# EAGLE design Board_Core (EAGLE 8.2.0)
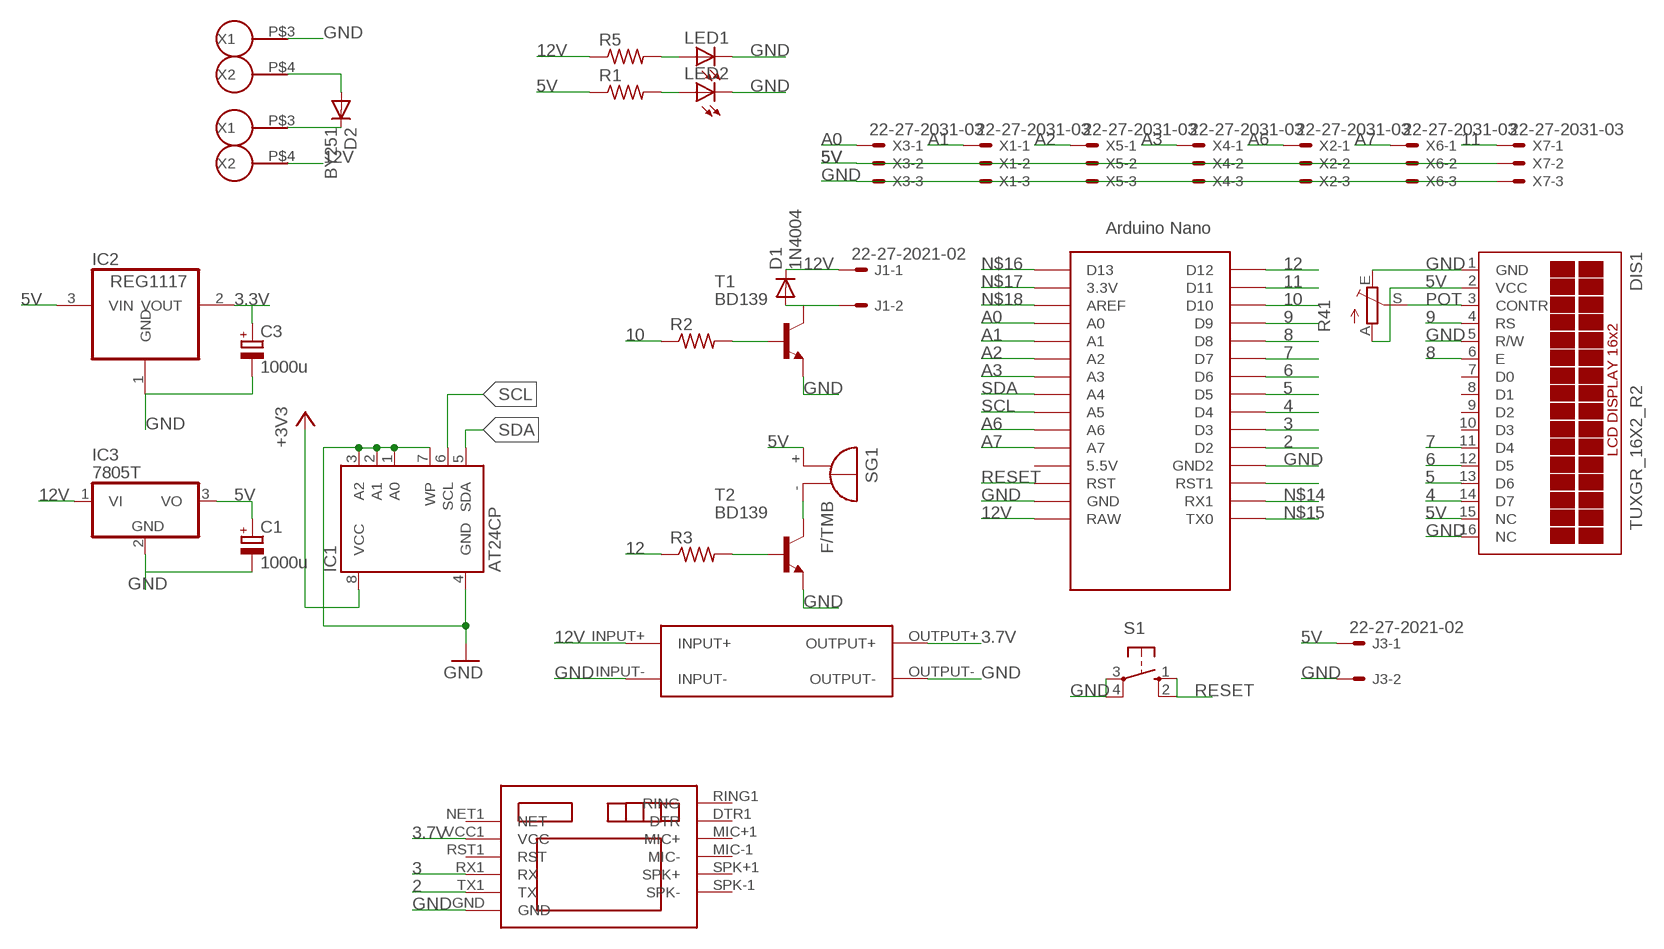
[diagram p0: schematic, sheet 1]

## Parts
C1  1000u  CPOL-EUE5-10.5  [E5-10,5]
C3  1000u  CPOL-EUE5-10.5  [E5-10,5]
D1  1N4004  [DO41-10]
D2  BY251  [DO201-15]
DIS1  TUXGR_16X2_R2  [TUXGR_16X2_R2]
IC1  AT24CP  [DIL08]
IC2  REG1117  [SOT223]
IC3  7805T  [TO220H]
J1  22-27-2021-02  [6410-02]
J3  22-27-2021-02  [6410-02]
LED1  LED5MM  [LED5MM]
LED2  LED5MM  [LED5MM]
R1  R-US_0207/10  [0207/10]
R2  R-US_0207/10  [0207/10]
R3  R-US_0207/10  [0207/10]
R5  R-US_0207/10  [0207/10]
R41  TRIM_EU-CA6V  [CA6V]
S1  40-XX  [B3F-40XX]
SG1  F/TMB  [F/TMB]
T1  BD139  [TO126]
T2  BD139  [TO126]
U$1  NANO  [NANO]
U$2  UBEC  [UBEC]
U$3  TB9.5  [TB9.5]
U$4  SIM800L(F.D)  [SIM800L]
U$8  TB9.5  [TB9.5]
X1  22-27-2031-03  [6410-03]
X2  22-27-2031-03  [6410-03]
X3  22-27-2031-03  [6410-03]
X4  22-27-2031-03  [6410-03]
X5  22-27-2031-03  [6410-03]
X6  22-27-2031-03  [6410-03]
X7  22-27-2031-03  [6410-03]

## Nets
2: U$1.D2 U$4.TX1(TX)
3: U$1.D3 U$4.RX1(RX)
3.3V: C3.+ IC1.8(VCC) IC2.2(VOUT) ; supply symbol labelled +3V3
3.7V: U$2.OUTPUT+ U$4.VCC1(VCC)
4: DIS1.14(D7) U$1.D4
5: DIS1.13(D6) U$1.D5
5V: C1.+ DIS1.2(VCC) DIS1.15(NC) IC2.3(VIN) IC3.3(VO) J3.1 R1.1 R41.A SG1.+ X1.2 X2.2 X3.2 X4.2 X5.2 X6.2 X7.2
6: DIS1.12(D5) U$1.D6
7: DIS1.11(D4) U$1.D7
8: DIS1.6(E) U$1.D8
9: DIS1.4(RS) U$1.D9
10: R2.1 U$1.D10
11: U$1.D11 X7.1
12: R3.1 U$1.D12
12V: D1.C IC3.1(VI) J1.1 R5.1 U$1.RAW U$2.INPUT+ U$3.P$4(X2)
A0: U$1.A0 X3.1
A1: U$1.A1 X1.1
A2: U$1.A2 X5.1
A3: U$1.A3 X4.1
A6: U$1.A6 X2.1
A7: U$1.A7 X6.1
GND: C1.- C3.- DIS1.1(GND) DIS1.5(R/W) DIS1.16(NC) IC1.1(A0) IC1.2(A1) IC1.3(A2) IC1.4(GND) IC1.7(WP) IC2.1(GND) IC3.2(GND) J3.2 LED1.K(C) LED2.K(C) R41.E S1.3(P) S1.4(P1) T1.1(E) T2.1(E) U$1.GND U$1.GND1(GND2) U$2.INPUT- U$2.OUTPUT- U$4.GND U$8.P$3(X1) X1.3 X2.3 X3.3 X4.3 X5.3 X6.3 X7.3
GND1: D2.A U$8.P$4(X2)
N$3: LED1.A R5.2
N$4: R2.2 T1.3(B)
N$5: D1.A J1.2 T1.2(C)
N$6: U$1.RST1
N$8: LED2.A R1.2
N$9: D2.C U$3.P$3(X1)
N$10: R3.2 T2.3(B)
N$11: SG1.- T2.2(C)
N$14: U$1.RX1
N$15: U$1.TX0
N$16: U$1.D13
N$17: U$1.3.3V
N$18: U$1.AREF
POT: DIS1.3(CONTR) R41.S
RESET: S1.1(S) S1.2(S1) U$1.RST
SCL: IC1.6(SCL) U$1.A5
SDA: IC1.5(SDA) U$1.A4
Unconnected: DIS1.7(D0) DIS1.8(D1) DIS1.9(D2) DIS1.10(D3) U$1.5V(5.5V) U$1.ICSP1 U$1.ICSP2 U$1.ICSP3 U$1.ICSP4 U$1.ICSP5 U$1.ICSP6 U$4.DTR1(DTR) U$4.MIC+1(MIC+) U$4.MIC-1(MIC-) U$4.NET1(NET) U$4.RING1(RING) U$4.RST1(RST) U$4.SPK+1(SPK+) U$4.SPK-1(SPK-)

## Library data of the parts
C1 C3 = rcl:CPOL-EU: POLARIZED CAPACITOR, European symbol
D1 = adafruit:1N4004: DIODE General purpose 1N400x type rectifier (With bigger pads) http://www.ladyada.net/library/pcb/eaglelibrary.html
D2 = diode:BY251: DIODE Si, 200 V, 3 A
DIS1 = display-lcd:TUXGR_16X2_R2: Tuxgraphics LCD display 16x2 characters reflective, without background light Source: tuxgr_12x2_r2.pdf; OC_FARNELL: unknown; OC_NEWARK: unknown
IC1 = atmel:AT24C*: 2-wire serial EEPROM; MPN: AT24C1024BW-SH-B; OC_FARNELL: 1362646; OC_NEWARK: 03P2044
IC2 = burr-brown:REG1117: 800mA and 1A Low Dropout (LDO) Positive Regulator 1.8V, 2.5V, 2.85V, 3.3V, 5V, and Adj; MPN: REG1117; OC_FARNELL: 1097566; OC_NEWARK: 14P6981
IC3 = linear:78*: Positive VOLTAGE REGULATOR Source: http://cache.national.com/ds/LM/LM78L05.pdf http://www.fairchildsemi.com/ds/LM/LM7805.pdf
J1 J3 = con-molex:22-?-02: CONNECTOR wire to board 2.54 mm (.1 inch) pitch header; MF: MOLEX; OC_FARNELL: unknown; OC_NEWARK: unknown
LED1 LED2 = adafruit:LED: LED OSRAM: - CHIPLED LG R971, LG N971, LY N971, LG Q971, LY Q971, LO R971, LY R971 LH N974, LH R974 LS Q976, LO Q976, LY Q976 LO Q996 - Hyper CHIPLED LW Q18S LB Q993, LB Q99A, LB R99A - SideLED LS A670, LO A670, LY A670, LG A670, LP A670 LB A673, LV A673, LT A673, LW A673 LH A674 LY A675 LS A676, LA A676, LO A676, LY A676, LW A676 LS A679, LY A679, LG A679 - Hyper Micro SIDELED® LS Y876, LA Y876, LO Y876, LY Y876 LT Y87S - SmartLED LW L88C, LW L88S LB L89C, LB L89S, LG L890 LS L89K, LO L89K, LY L89K LS L896, LA L896, LO L896, LY L896 - TOPLED LS T670, LO T670, LY T670, LG T670, LP T670 LSG T670, LSP T670, LSY T670, LOP T670, LYG T670 LG T671, LOG T671, LSG T671 LB T673, LV T673, LT T673, LW T673 LH T674 LS T676, LA T676, LO T676, LY T676, LB T676, LH T676, LSB T676, LW T676 LB T67C, LV T67C, LT T67C, LS T67K, LO T67K, LY T67K, LW E67C LS E67B, LA E67B, LO E67B, LY E67B, LB E67C, LV E67C, LT E67C LW T67C LS T679, LY T679, LG T679 LS T770, LO T770, LY T770, LG T770, LP T770 LB T773, LV T773, LT T773, LW T773 LH T774 LS E675, LA E675, LY E675, LS T675 LS T776, LA T776, LO T776, LY T776, LB T776 LHGB T686 LT T68C, LB T68C - Hyper Mini TOPLED® LB M676 - Mini TOPLED Santana® LG M470 LS M47K, LO M47K, LY M47K Source: http://www.osram.convergy.de/
R1-R3 R5 = adafruit:R-US_: RESISTOR, American symbol
R41 = pot:TRIM_EU-: POTENTIOMETER
S1 = switch-omron:40-XX: OMRON SWITCH
SG1 = buzzer:F/TMB: BUZZER Source: Buerklin; OC_FARNELL: unknown; OC_NEWARK: unknown
T1 T2 = transistor:BD139: NPN TRANSISTOR
U$1 = Arduino-clone:NANO: Arduino Nano
U$2 = ubec:UBEC
U$3 U$8 = TB9.5:TB9.5
U$4 = sim800l:SIM800L(F.D)
X1-X7 = con-molex:22-?-03: CONNECTOR wire to board 2.54 mm (.1 inch) pitch header; MF: MOLEX; OC_FARNELL: unknown; OC_NEWARK: unknown

## Board
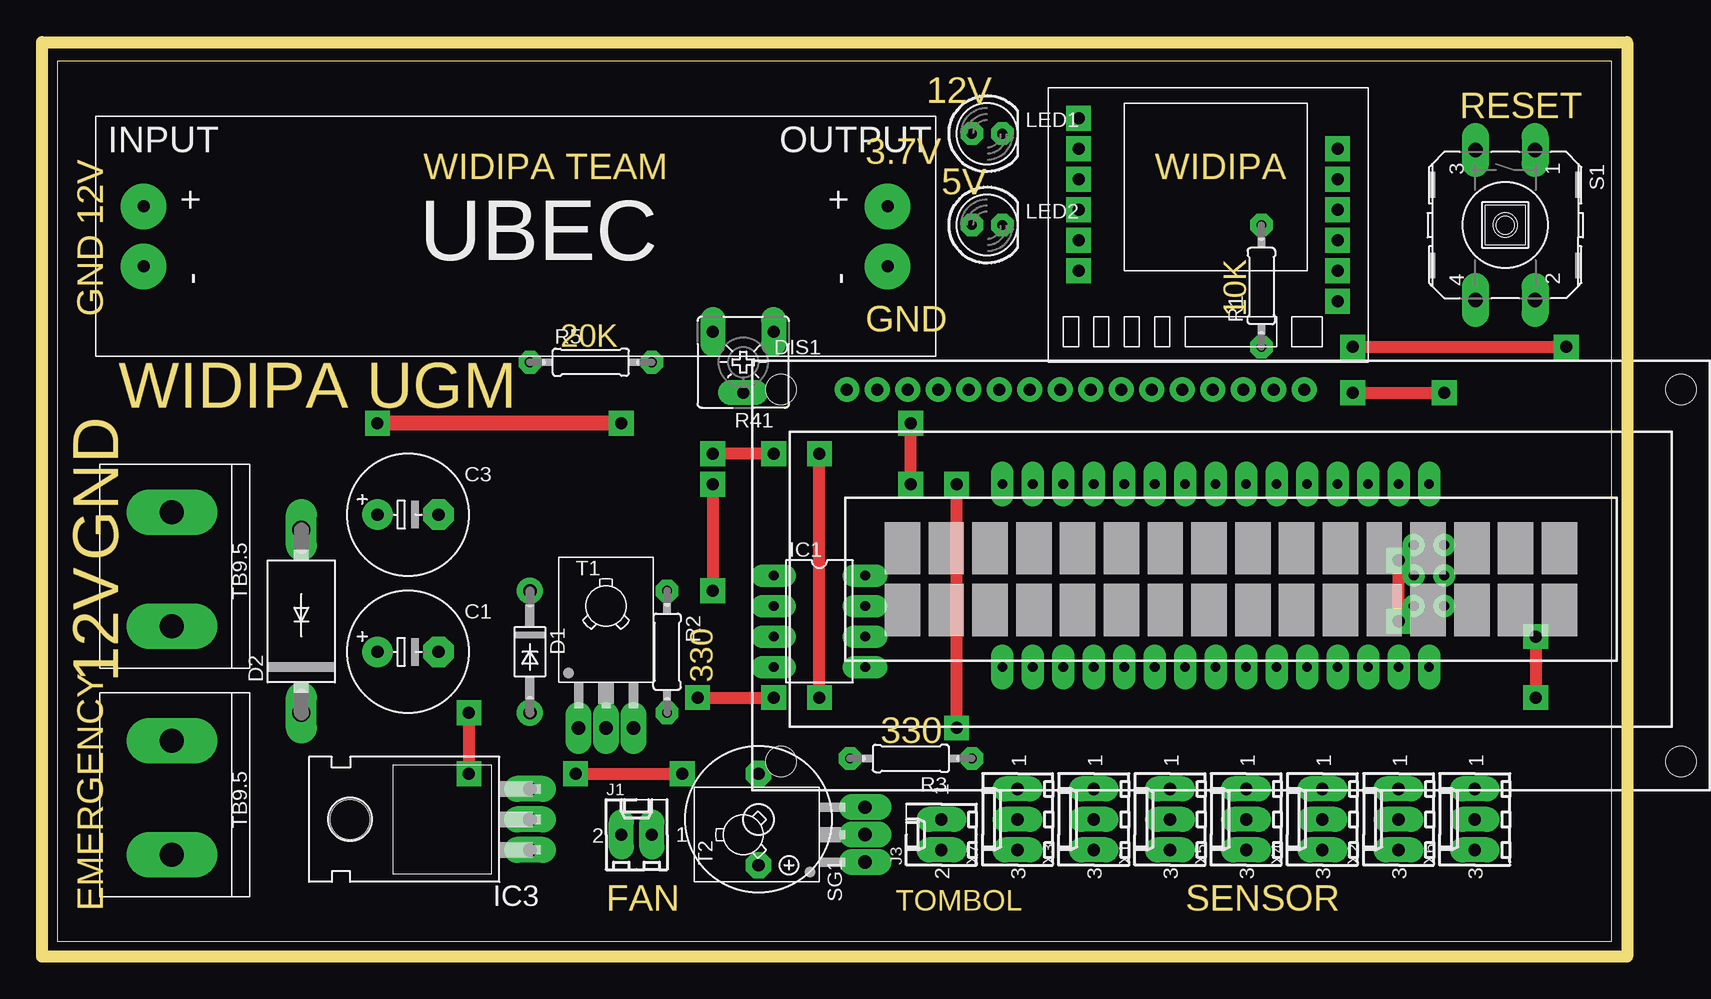
[diagram p1: board, top side]
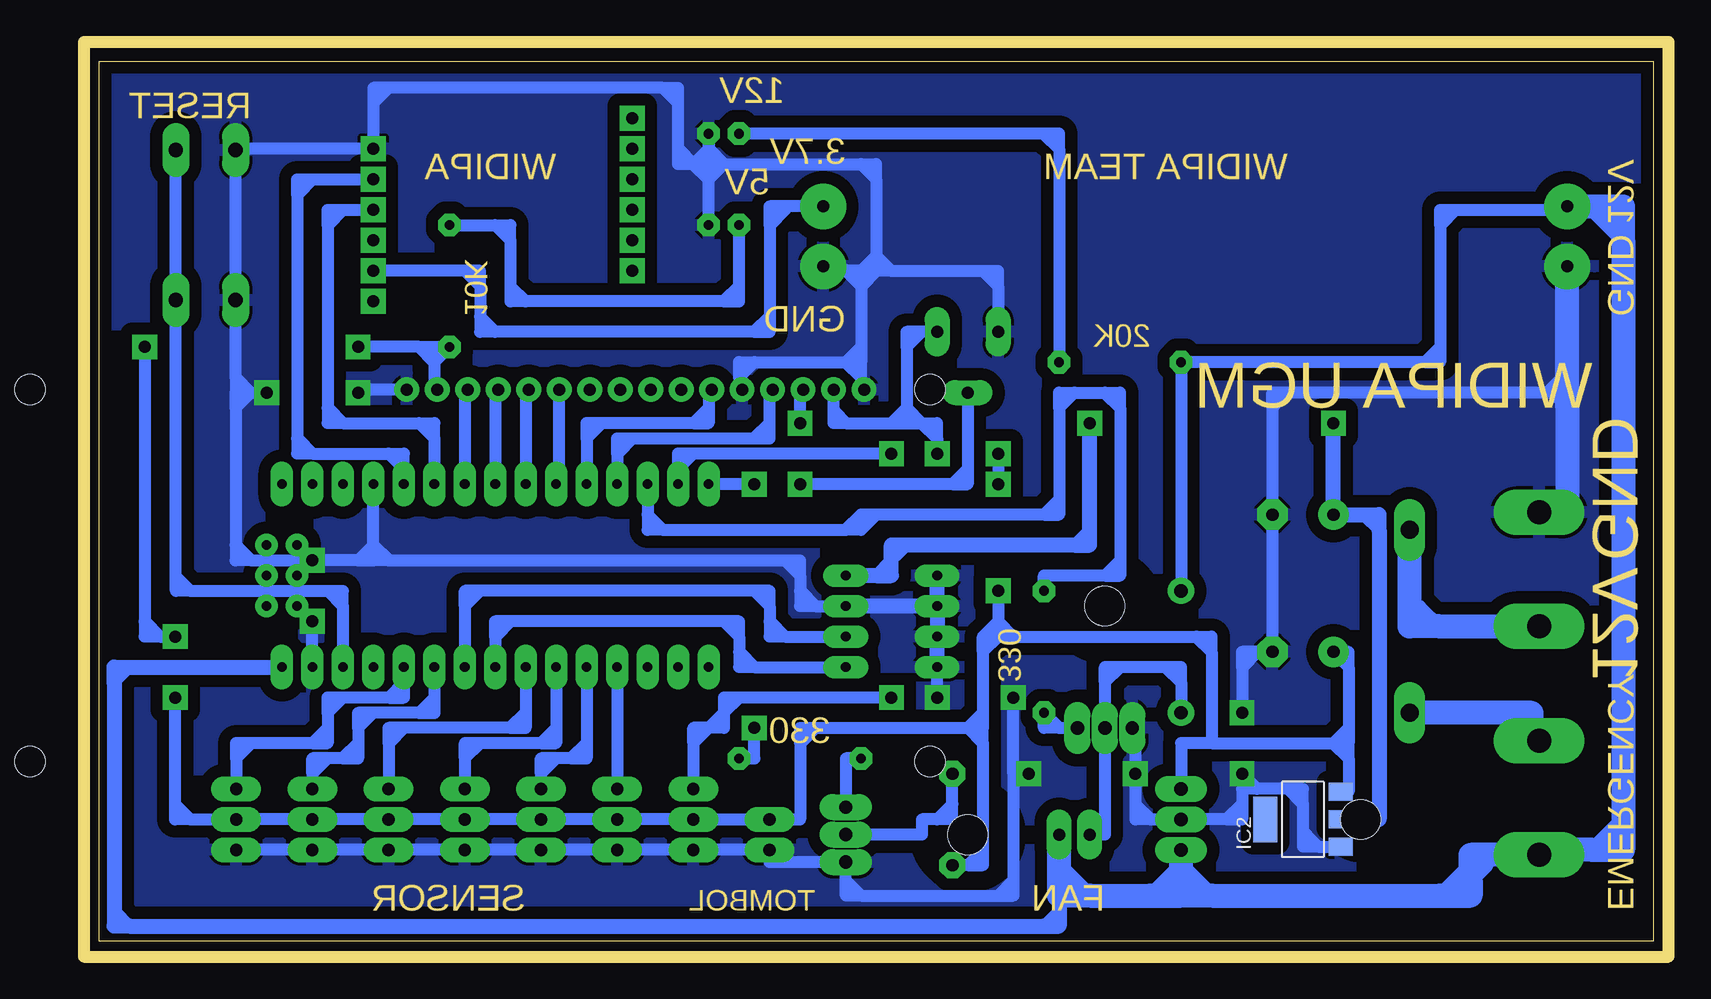
[diagram p2: board, bottom side, seen from below]

Size 132.08 x 76.2 mm. Coordinates in mm from the lower left corner, seen from the top.
Outline: 1.27,1.27 130.79,1.27 130.79,74.6 1.27,74.6 1.27,1.27
Outline: 0,76.2 132.08,76.2 132.08,0 0,0 0,76.2
Copper layers (1*16): Top 0.035mm / dielectric 1.5mm / Bottom 0.035mm
Design rules "default *": minimum track width 6mil, minimum drill 0.35mm, track to track 6mil, track to pad 6mil, pad to pad 6mil, via to via 6mil, smd to smd 6mil, copper to edge 40mil, drill to drill 6mil, minimum pad ring 21mil, minimum via ring 21mil, stop-mask expansion 4mil, vias tented up to drill 0mil, thermal gap 10mil

### Footprints (pad centres in the part's own frame; a part is rotated, then mirrored left to right if it is on the bottom)
E5-10,5 = drill 1.016 pad 2.54: + -2.54,0 | drill 1.016 pad 2.54 octagon: - 2.54,0
DO41-10 = drill 1.118 pad 1.93: A 5.08,0; C -5.08,0
DO201-15 = drill 1.499 long: A 7.62,0; C -7.62,0
TUXGR_16X2_R2 = drill 1 pad 1.676: 1 -32,15.5; 2 -29.46,15.5; 3 -26.92,15.5; 4 -24.38,15.5; 5 -21.84,15.5; 6 -19.3,15.5; 7 -16.76,15.5; 8 -14.22,15.5; 9 -11.68,15.5; 10 -9.14,15.5; 11 -6.6,15.5; 12 -4.06,15.5; 13 -1.52,15.5; 14 1.02,15.5; 15 3.56,15.5; 16 6.1,15.5 | hole 2.5: -37.5,-15.5; 37.5,-15.5; -37.5,15.5; 37.5,15.5
DIL08 = drill 0.813 long: 1 -3.81,-3.81; 2 -1.27,-3.81; 3 1.27,-3.81; 4 3.81,-3.81; 5 3.81,3.81; 6 1.27,3.81; 7 -1.27,3.81; 8 -3.81,3.81
SOT223 = smd 1.499 x 2.007: 1 -2.261,-3.15; 2 0.025,-3.15; 3 2.311,-3.15 | smd 3.81 x 2.007: 4 0,3.15
TO220H = drill 1.118 long: 1 -2.54,-10.16; 2 0,-10.16; 3 2.54,-10.16 | hole 3.302: 0,4.826
6410-02 = drill 1.016 long: 1 1.27,0; 2 -1.27,0
LED5MM = drill 0.813 pad 1.676 octagon: A -1.27,0; K 1.27,0
0207/10 = drill 0.813 pad 1.676 octagon: 1 -5.08,0; 2 5.08,0
CA6V = drill 1.016 long: A -2.54,-2.54; E 2.54,-2.54; S 0,2.54
B3F-40XX = drill 1.194 long: 1 -6.248,2.489; 2 6.248,2.489; 3 -6.248,-2.489; 4 6.248,-2.489
F/TMB = drill 1.016 pad 2.159 octagon: + 3.81,0; - -3.81,0
TO126 = drill 1.118 long: 1 -2.286,-5.08; 2 0,-5.08; 3 2.286,-5.08 | hole 3.302: 0,5.08
NANO = drill 0.8 long: 3.3V -10.16,24.13; 5V -10.16,-1.27; A0 -10.16,19.05; A1 -10.16,16.51; A2 -10.16,13.97; A3 -10.16,11.43; A4 -10.16,8.89; A5 -10.16,6.35; A6 -10.16,3.81; A7 -10.16,1.27; AREF -10.16,21.59; D2 5.08,1.27; D3 5.08,3.81; D4 5.08,6.35; D5 5.08,8.89; D6 5.08,11.43; D7 5.08,13.97; D8 5.08,16.51; D9 5.08,19.05; D10 5.08,21.59; D11 5.08,24.13; D12 5.08,26.67; D13 -10.16,26.67; GND -10.16,-6.35; GND1 5.08,-1.27; RAW -10.16,-8.89; RST -10.16,-3.81; RST1 5.08,-3.81; RX1 5.08,-6.35; TX0 5.08,-8.89 | drill 0.8: ICSP1 -5.08,-10.16; ICSP2 -5.08,-7.62; ICSP3 -2.54,-10.16; ICSP4 -2.54,-7.62; ICSP5 0,-10.16; ICSP6 0,-7.62
UBEC = drill 1 pad 3.81: INPUT+ -36,-17.5; INPUT- -36,-22.5; OUTPUT+ 26,-17.5; OUTPUT- 26,-22.5
TB9.5 = drill 2 pad 3.81 long: P$3 -4,7; P$4 5.5,7
SIM800L = drill 1 pad 1.778 square: DTR1 0,0; GND -21.59,-7.62; MIC+1 0,-2.54; MIC-1 0,-5.08; NET1 -21.59,5.08; RING1 0,2.54; RST1 -21.59,0; RX1 -21.59,-2.54; SPK+1 0,-7.62; SPK-1 0,-10.16; TX1 -21.59,-5.08; VCC1 -21.59,2.54
6410-03 = drill 1.016 long: 1 2.54,0; 2 0,0; 3 -2.54,0

### Placement (x,y rotation side)
C1  30.48,25.4 0 top
C3  30.48,36.83 0 top
D1  40.64,25.4 270 top
D2  21.59,27.94 90 top
DIS1  99.06,31.75 0 top
IC1  64.77,27.94 270 top
IC2  30.48,11.43 90 bottom
IC3  30.48,11.43 90 top
J1  49.53,10.16 0 top
J3  74.93,10.16 90 top
LED1  78.74,68.58 0 top
LED2  78.74,60.96 0 top
R1  101.6,55.88 90 top
R2  52.07,25.4 270 top
R3  72.39,16.51 180 top
R5  45.72,49.53 0 top
R41  58.42,49.53 180 top
S1  121.92,60.96 270 top
SG1  59.69,11.43 270 top
T1  46.99,24.13 0 top
T2  63.5,10.16 90 top
U$1  106.68,34.29 90 top
U$2  44.45,80.01 0 top
U$3  3.81,13.97 270 top
U$4  86.36,59.69 180 top
U$8  3.81,33.02 270 top
X1  93.98,11.43 90 top
X2  113.03,11.43 90 top
X3  87.63,11.43 90 top
X4  106.68,11.43 90 top
X5  100.33,11.43 90 top
X6  119.38,11.43 90 top
X7  81.28,11.43 90 top

### Tracks (layer width: path | path; a pad name or v marks a point on that pad's centre or on a via)
2
  Bottom 1.016: 105.41,40.64 U$1.D2 | 105.41,40.64 105.41,41.91 113.03,41.91 | 113.03,41.91 114.3,41.91 114.3,63.5 | 114.3,63.5 114.3,64.77 U$4.TX1 | 106.68,41.91 105.41,40.64 | 114.3,43.18 113.03,41.91 | 113.03,64.77 114.3,63.5
3
  Bottom 1.016: 102.87,43.18 U$1.D3 | 102.87,43.18 102.87,44.45 110.49,44.45 | 110.49,44.45 111.76,44.45 111.76,60.96 | 111.76,60.96 111.76,62.23 U$4.RX1 | 104.14,44.45 102.87,43.18 | 111.76,45.72 110.49,44.45 | 110.49,62.23 111.76,60.96
3.3V  (via drill 1 pad 2)
  Top 1.27: v48.26,44.45 v27.94,44.45
  Bottom 1.016: 25.4,36.83 24.13,35.56 | 24.13,12.7 25.4,11.43 | 65.41,32.39 64.77,33.02 | 65.41,32.39 66.04,31.75 | 63.5,34.29 65.41,32.39 | 48.26,35.56 49.53,34.29
  Bottom 1.27: IC1.8 66.04,31.75 64.77,31.75 64.77,34.29 49.53,34.29 48.26,34.29 v48.26,44.45 | v27.94,44.45 C3.+ 24.13,36.83 24.13,35.56 24.13,11.43 25.4,11.43 27.33,11.43 IC2.2
3.7V
  Bottom 1.016: U$2.OUTPUT+ 74.93,62.51 74.93,60.96 | 74.93,60.96 74.93,52.07 76.2,52.07 | 76.2,52.07 97.79,52.07 | 97.79,52.07 99.06,52.07 99.06,55.88 | 99.06,55.88 99.06,57.15 U$4.VCC1 | 100.33,57.15 99.06,55.88 | 99.06,53.34 97.79,52.07 | 74.93,53.34 76.2,52.07 | 73.66,62.51 73.66,62.23 74.93,60.96
4
  Bottom 1.016: DIS1.14 100.33,47.25 U$1.D4
5
  Bottom 1.016: DIS1.13 97.79,47.25 U$1.D5
5V  (via drill 1 pad 2)
  Top 1.016: v60.96,41.91 v55.88,41.91 | v55.88,39.37 v55.88,30.48 | v109.22,50.8 v127,50.8 | v124.46,26.67 v124.46,21.59
  Bottom 1.016: IC2.3 26.67,13.74 26.67,16.51 | 26.67,16.51 26.67,17.78 | 26.67,24.13 26.67,17.78 | 26.67,24.13 26.67,25.4 C1.+ 26.67,24.13 | DIS1.15 102.87,47.25 102.87,49.53 | 102.87,49.53 102.87,50.8 R1.1 | IC3.3 40.64,17.78 38.1,17.78 | 38.1,17.78 27.94,17.78 | 27.94,17.78 26.67,17.78 | 57.15,26.67 55.88,26.67 | 54.61,26.67 55.88,26.67 | 54.61,26.67 38.1,26.67 38.1,25.4 | 38.1,25.4 38.1,17.78 | R41.A 63.5,52.07 63.5,50.8 | 63.5,50.8 63.5,44.45 | 64.77,44.45 63.5,44.45 | 68.58,44.45 64.77,44.45 | 68.58,44.45 69.6,44.45 DIS1.2 | 63.5,44.45 62.23,44.45 | 62.23,44.45 60.96,44.45 60.96,43.18 | 60.96,43.18 v60.96,41.91 | v55.88,30.48 55.88,26.67 | v55.88,41.91 v55.88,39.37 | 104.14,50.8 R1.1 | 104.14,50.8 v109.22,50.8 | v127,50.8 127,26.67 125.73,26.67 | 125.73,26.67 v124.46,26.67 | 123.19,11.43 X6.2 X2.2 X4.2 X5.2 X1.2 X3.2 X7.2 J3.1 72.39,11.43 72.39,17.78 | 123.19,11.43 124.46,11.43 v124.46,21.59 | 58.42,7.62 SG1.+ | 58.42,7.62 57.15,7.62 57.15,17.78 | 57.15,17.78 57.15,19.05 | 57.15,25.4 57.15,19.05 | 57.15,25.4 57.15,26.67 | 72.39,17.78 72.39,19.05 58.42,19.05 | 58.42,19.05 57.15,19.05 | 62.23,52.07 63.5,50.8 | 62.23,44.45 63.5,45.72 64.77,44.45 | 62.23,44.45 60.96,43.18 | 26.67,19.05 27.94,17.78 | 27.94,17.78 26.67,16.51 | 39.37,26.67 38.1,25.4 | 55.88,26.67 57.15,25.4 | 54.61,26.67 55.88,27.94 57.15,26.67 | 57.15,20.32 58.42,19.05 | 58.42,19.05 57.15,17.78 | 57.15,8.89 58.42,7.62 | 71.12,19.05 72.39,17.78 | 124.46,12.7 123.19,11.43 | 69.6,45.72 69.6,45.47 68.58,44.45 | 102.87,49.53 104.14,50.8 | R1.1 102.87,49.53 | 127,27.94 125.73,26.67
6
  Bottom 1.016: DIS1.12 95.25,47.25 U$1.D6
7
  Bottom 1.016: U$1.D7 92.46,39.37 DIS1.11
8
  Bottom 1.016: DIS1.6 80.01,47.25 80.01,44.45 81.28,44.45 | 90.17,43.18 90.17,44.45 81.28,44.45 | 90.17,43.18 U$1.D8 | 88.9,44.45 90.17,43.18 | 80.01,45.72 81.28,44.45
9
  Bottom 1.016: 74.93,47.25 DIS1.4 74.93,47.25 | 87.63,41.91 87.63,43.18 76.2,43.18 | 87.63,41.91 U$1.D9 | 74.93,44.45 74.93,47.25 | 74.93,44.45 76.2,43.18 | 86.36,43.18 87.63,41.91 | 76.2,43.18 74.93,43.18 74.93,44.45
10
  Bottom 1.016: R2.1 52.07,31.75 46.99,31.75 | 46.99,31.75 45.72,31.75 45.72,45.72 | 45.72,45.72 45.72,46.99 50.8,46.99 50.8,45.72 | U$1.D10 85.09,35.56 83.82,35.56 | 83.82,35.56 68.58,35.56 | 67.31,35.56 68.58,35.56 | 67.31,35.56 67.31,36.83 | 52.07,36.83 67.31,36.83 | 52.07,36.83 50.8,36.83 50.8,45.72 | 67.31,36.83 68.58,35.56 | 66.04,36.83 67.31,35.56 | 50.8,38.1 52.07,36.83 | 45.72,33.02 46.99,31.75 | 46.99,46.99 45.72,45.72 | 49.53,46.99 50.8,45.72 | 85.09,36.83 83.82,35.56
11  (via drill 1 pad 2)
  Top 1.016: v64.77,21.59 v64.77,41.91
  Bottom 1.016: v64.77,41.91 82.55,41.91 82.55,40.64 | 82.55,40.64 U$1.D11 | v64.77,21.59 78.74,21.59 78.74,20.32 | 78.74,20.32 78.74,19.05 80.01,19.05 | 80.01,19.05 81.28,19.05 81.28,17.78 | 81.28,17.78 X7.1 | 77.47,21.59 78.74,20.32 | 78.74,20.32 80.01,19.05 | 80.01,19.05 81.28,17.78 | 81.28,41.91 82.55,40.64
12  (via drill 1 pad 2)
  Top 1.016: v76.2,19.05 v76.2,39.37
  Bottom 1.016: R3.1 76.2,16.51 v76.2,19.05 | v76.2,39.37 U$1.D12
12V
  Bottom 1.016: 19.05,60.96 19.05,62.23 8.45,62.23 U$2.INPUT+ | 19.05,60.96 19.05,49.53 20.32,49.53 | 20.32,49.53 R5.1 D1.C | 17.78,62.23 19.05,60.96 | 19.05,50.8 20.32,49.53 | 50.8,3.81 52.07,2.54 | 129.54,3.81 128.27,2.54 | 128.27,24.13 129.54,22.86
  Bottom 1.27: 50.8,5.08 50.8,2.54 52.07,2.54 128.27,2.54 129.54,2.54 129.54,22.86 129.54,24.13 U$1.RAW | 6.35,62.51 6.35,62.23 3.81,59.69 | 15.24,8.47 15.24,7.62 16.51,6.35 | 16.51,8.47 16.51,7.62 19.05,5.08 | 3.81,11.43 6.35,8.89 | 40.64,7.62 38.1,5.08 | IC3.1 40.64,7.62 | 40.64,7.62 43.18,5.08 | 50.8,7.62 48.26,5.08
  Bottom 2: 40.64,5.08 38.1,5.08 19.05,5.08 16.51,5.08 16.51,6.35 16.51,8.47 U$3.P$4 10.81,8.89 6.35,8.89 3.81,8.89 3.81,59.69 3.81,62.51 U$2.INPUT+ | 40.64,5.08 IC3.1 | 40.64,5.08 43.18,5.08 48.26,5.08 50.8,5.08 J1.1
A0
  Bottom 1.016: U$1.A0 X3.1
A1
  Bottom 1.016: U$1.A1 90.17,16.51 91.44,16.51 | 91.44,16.51 93.98,16.51 93.98,15.24 | 93.98,15.24 X1.1 | 92.71,16.51 93.98,15.24 | 90.17,17.78 91.44,16.51
A2
  Bottom 1.016: U$1.A2 92.71,17.78 93.98,17.78 | 93.98,17.78 100.33,17.78 100.33,16.51 | 100.33,16.51 X5.1 | 99.06,17.78 100.33,16.51 | 92.71,19.05 93.98,17.78
A3
  Bottom 1.016: U$1.A3 95.25,19.05 96.52,19.05 | 96.52,19.05 106.68,19.05 106.68,17.78 | 106.68,17.78 X4.1 | 105.41,19.05 106.68,17.78 | 95.25,20.32 96.52,19.05
A6
  Bottom 1.016: U$1.A6 102.87,20.32 104.14,20.32 | 104.14,20.32 109.22,20.32 109.22,19.05 | 109.22,19.05 109.22,16.51 110.49,16.51 | 110.49,16.51 113.03,16.51 113.03,15.24 | 113.03,15.24 X2.1 | 102.87,21.59 104.14,20.32 | 107.95,20.32 109.22,19.05 | 109.22,17.78 110.49,16.51 | 111.76,16.51 113.03,15.24
A7
  Bottom 1.016: U$1.A7 105.41,21.59 106.68,21.59 | 106.68,21.59 111.76,21.59 111.76,20.32 | 111.76,20.32 111.76,17.78 113.03,17.78 | 113.03,17.78 119.38,17.78 119.38,16.51 | 119.38,16.51 X6.1 | 118.11,17.78 119.38,16.51 | 111.76,19.05 113.03,17.78 | 110.49,21.59 111.76,20.32 | 105.41,22.86 106.68,21.59
GND  (via drill 1 pad 2)
  Top 1.016: v113.03,27.94 v113.03,33.02 | v109.22,46.99 v116.84,46.99 | v44.45,15.24 v53.34,15.24 | v54.61,21.59 v60.96,21.59 | v35.56,20.32 v35.56,15.24
  Bottom 1.016: T1.1 44.45,19.05 v44.45,15.24 44.45,11.43 43.18,11.43 | 43.18,11.43 IC3.2 36.83,11.43 | 33.02,45.72 C3.- C1.- | 33.02,45.72 33.02,46.99 10.16,46.99 | 8.45,46.99 9.72,46.99 | DIS1.1 67.31,47.25 67.31,48.26 | 67.31,48.26 67.31,49.53 | 67.31,55.88 67.31,57.15 | 67.31,55.88 67.31,49.53 | 67.31,57.15 70.45,57.15 U$2.OUTPUT- 68.94,57.51 67.31,55.88 | DIS1.5 77.47,47.25 77.47,48.26 | 77.47,48.26 77.47,49.53 68.58,49.53 | 68.58,49.53 67.31,49.53 | 29.21,9.17 IC2.1 | 29.21,9.17 30.48,9.17 30.48,12.7 | 30.48,12.7 30.48,13.97 35.56,13.97 | 35.56,13.97 35.56,11.43 36.83,11.43 | 81.28,66.04 82.55,66.04 82.55,72.39 83.82,72.39 | 81.28,66.04 80.01,66.04 | 78.74,66.04 80.01,66.04 | 78.74,66.04 66.04,66.04 66.04,64.77 | 66.04,64.77 66.04,57.15 | 66.04,57.15 67.31,57.15 | 107.95,71.12 107.95,72.39 83.82,72.39 | 107.95,71.12 U$4.GND 119.43,67.31 S1.3 S1.4 119.43,48.26 | U$1.GND v113.03,27.94 | 109.22,33.02 107.95,33.02 | 109.22,33.02 v113.03,33.02 118.11,33.02 | 107.95,33.02 U$1.GND1 | 118.11,33.02 119.43,33.02 119.43,45.72 | 119.43,45.72 119.43,46.99 | 119.43,48.26 119.43,46.99 | DIS1.16 109.22,47.25 v109.22,46.99 | 119.43,46.99 v116.84,46.99 | 71.12,29.21 IC1.7 | 71.12,29.21 72.39,29.21 72.39,31.75 | 72.39,31.75 72.39,33.02 106.68,33.02 | 106.68,33.02 107.95,33.02 | 55.88,55.88 R41.E | 55.88,55.88 55.88,57.15 64.77,57.15 | 64.77,57.15 66.04,57.15 | v53.34,15.24 54.61,15.24 | 54.61,15.24 v54.61,21.59 | v60.96,21.59 IC1.4 | 35.56,13.97 v35.56,15.24 34.29,13.97 | C1.- 35.56,25.4 35.56,24.13 | 35.56,24.13 v35.56,20.32 | J3.2 74.93,9.14 | J3.2 X7.3 X3.3 X1.3 X5.3 X4.3 X2.3 X6.3 | 55.88,5.08 54.61,5.08 54.61,15.24 | 67.31,5.08 55.88,5.08 | 67.31,5.08 68.58,5.08 T2.1 74.93,7.87 J3.2
  Bottom 1.016: 31.75,46.99 33.02,45.72 | 57.15,57.15 55.88,55.88 | 67.31,66.04 66.04,64.77 | 64.77,57.15 66.04,58.42 67.31,57.15 | 66.04,57.15 67.31,55.88 | 67.31,50.8 68.58,49.53 | 68.58,49.53 67.31,48.26 | 8.45,48.26 8.89,48.26 10.16,46.99 | 10.16,46.99 9.72,46.99 | 9.72,46.99 8.45,45.72 | 31.75,13.97 30.48,12.7 | 35.56,12.7 36.83,11.43 | 30.48,10.16 30.2,10.16 29.21,9.17 | C1.- 34.29,25.4 35.56,24.13 | 44.45,12.7 43.18,11.43 | 54.61,6.35 55.88,5.08 | 68.58,6.35 67.31,5.08 | 76.2,49.53 77.47,48.26 | 118.16,46.99 119.43,45.72 | 118.11,46.99 118.16,46.99 | 118.16,46.99 119.43,48.26 | 119.43,34.29 119.38,34.29 118.11,33.02 | 106.68,72.39 107.95,71.12 | 72.39,30.48 71.12,29.21 | 106.68,33.02 107.95,34.29 109.22,33.02 | 73.66,33.02 72.39,31.75 | LED2.K 80.01,64.77 | 80.01,64.77 80.01,66.04 | 80.01,66.04 LED1.K 80.01,67.31 | 80.01,67.31 78.74,66.04 | 80.01,67.31 81.28,66.04 | 81.28,66.04 80.01,64.77 | 80.01,64.77 78.74,66.04 | 82.55,71.12 83.82,72.39 | 82.55,67.31 81.28,66.04
  Bottom 1.27: IC1.2 IC1.1 | IC1.2 IC1.3 IC1.4 | IC1.2 IC1.7
  Bottom 2: U$8.P$3 8.45,37.02 8.45,45.72 8.45,46.99 U$2.INPUT-
  pour Bottom (isolate 1.016): 1.27,74.93 130.81,74.93 130.81,1.27 1.27,1.27
GND1
  Bottom 1.016: 21.59,29.21 20.74,29.21 19.05,27.52
  Bottom 2: U$8.P$4 19.05,27.52 21.59,27.52 D2.A
N$2
  Bottom 1.016: 0,76.2 132.08,76.2 132.08,0 0,0 0,76.2
N$3
  Bottom 1.016: 50.8,67.31 R5.2 | 50.8,67.31 50.8,68.58 LED1.A | 52.07,68.58 50.8,67.31
N$4
  Bottom 1.016: 50.8,19.05 T1.3 | 50.8,19.05 52.07,19.05 R2.2 50.8,19.05
N$5
  Bottom 1.016: J1.2 46.99,10.16 T1.2 46.99,22.86 | 40.64,22.86 D1.A | 40.64,22.86 40.64,24.13 46.99,24.13 46.99,22.86 | 41.91,24.13 40.64,22.86 | 45.72,24.13 46.99,22.86
N$8
  Bottom 1.016: R1.2 96.52,60.96 96.52,59.69 | 96.52,59.69 96.52,54.61 95.25,54.61 | 78.74,54.61 77.47,54.61 77.47,55.88 | 78.74,54.61 95.25,54.61 | 77.47,55.88 LED2.A | 97.79,60.96 96.52,59.69 | 96.52,55.88 95.25,54.61 | 77.47,55.88 78.74,54.61
N$9
  Bottom 2: U$3.P$3 11.43,17.97 11.43,20.32 D2.C
N$10
  Bottom 1.016: R3.2 68.58,16.51 T2.3
N$11
  Bottom 1.016: 60.96,11.43 59.69,11.43 SG1.- | 59.69,12.7 60.96,11.43 | 60.96,11.43 62.23,11.43 62.23,10.16 T2.2
POT  (via drill 1 pad 2)
  Top 1.016: v72.39,39.37 v72.39,44.45
  Bottom 1.016: 72.39,47.25 DIS1.3 72.14,46.99 72.39,46.99 v72.39,44.45 | 59.69,39.37 58.42,39.37 R41.S | 59.69,39.37 v72.39,39.37 | 58.42,40.64 59.69,39.37
RESET
  Bottom 1.016: S1.1 S1.2 124.41,30.48 123.19,30.48 | 110.49,29.21 U$1.RST | 110.49,29.21 110.49,30.48 123.19,30.48 | 111.76,30.48 110.49,29.21 | 124.41,31.75 124.41,31.7 123.19,30.48
SCL
  Bottom 1.016: 73.66,26.67 IC1.6 | 73.66,26.67 74.93,26.67 74.93,29.21 | 100.33,29.21 100.33,30.48 74.93,30.48 74.93,29.21 | 100.33,29.21 U$1.A5 | 99.06,30.48 100.33,29.21 | 74.93,27.94 73.66,26.67 | 76.2,30.48 74.93,29.21
SDA
  Bottom 1.016: 76.2,24.13 IC1.5 | 76.2,24.13 77.47,24.13 77.47,26.67 | 77.47,26.67 77.47,27.94 97.79,27.94 97.79,26.67 | 97.79,26.67 U$1.A4 | 96.52,27.94 97.79,26.67 | 78.74,27.94 77.47,26.67 | 77.47,25.4 76.2,24.13

### Text on the board
Dimension: 12V | RESET | 3.7V | WIDIPA TEAM | WIDIPA | 5V | 12V | GND | 10K | GND | 20K | WIDIPA UGM | GND | 12V | 330 | 330 | EMERGENCY | FAN | TOMBOL | SENSOR